# Altium project WSPRShield.PrjPcb
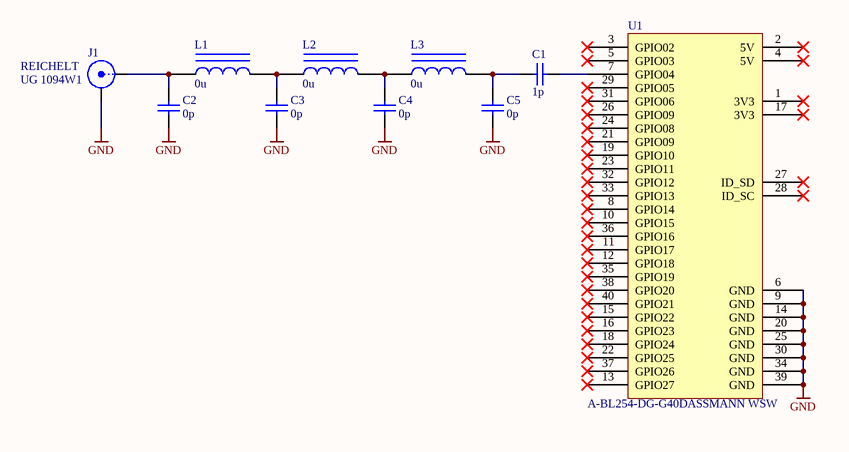
[diagram p0: WSPRShield.SchDoc]
1 sheet, 10 parts. Net scope: global (net labels, ports and power ports of the same name join across sheets).
Board file: WSPRShield.PcbDoc

## Sheet WSPRShield.SchDoc
size A4

### Parts
C1  value 1p  [CER-CO-5MM]  (hidden comment: Capacitor)
C2  value 0p  [CER-CO-5MM]  (hidden comment: Capacitor)
C3  value 0p  [CER-CO-5MM]  (hidden comment: Capacitor)
C4  value 0p  [CER-CO-5MM]  (hidden comment: Capacitor)
C5  value 0p  [CER-CO-5MM]  (hidden comment: Capacitor)
J1  Manufacturer: REICHELT  Type: UG 1094W1  [REICHELT_UG1094W1]  (hidden comment: COAX)
L1  value 0u  [T37-6]  (hidden comment: Inductor (IronCore))
L2  value 0u  [T37-6]  (hidden comment: Inductor (IronCore))
L3  value 0u  [T37-6]  (hidden comment: Inductor (IronCore))
U1  Type: A-BL254-DG-G40DASSMANN WSW  [RASPI_BPHAT]  (hidden comment: RaspberryPiB)

### Nets
GND: C2.1 C3.1 C4.1 C5.1 J1.2(Y) U1.6(GND) U1.9(GND) U1.14(GND) U1.20(GND) U1.25(GND) U1.30(GND) U1.34(GND) U1.39(GND)
NetC1_1: C1.1 U1.7(GPIO04)
NetC1_2: C1.2 C5.2 L3.2
NetC2_2: C2.2 J1.1(X) L1.1
NetC3_2: C3.2 L1.2 L2.1
NetC4_2: C4.2 L2.2 L3.1

Not connected (* = marked no-connect by the designer): U1 1(3V3)* 2(5V)* 3(GPIO02)* 4(5V)* 5(GPIO03)* 8(GPIO14)* 10(GPIO15)* 11(GPIO17)* 12(GPIO18)* 13(GPIO27)* 15(GPIO22)* 16(GPIO23)* 17(3V3)* 18(GPIO24)* 19(GPIO10)* 21(GPIO09)* 22(GPIO25)* 23(GPIO11)* 24(GPIO08)* 26(GPIO09)* 27(ID_SD)* 28(ID_SC)* 29(GPIO05)* 31(GPIO06)* 32(GPIO12)* 33(GPIO13)* 35(GPIO19)* 36(GPIO16)* 37(GPIO26)* 38(GPIO20)* 40(GPIO21)*

### Library data of the parts
C1-C5 = Capacitor: Manufacturer: Miscellaneous; Voltage: 100; Type: Miscellaneous
U1 = RaspberryPiB: Manufacturer: ASSMANN